# Altium schematic sheet NUCLEO-F410RB-Core.SchDoc: NUCLEO-F410RB 扩展板
size A4; Revision: V1.0
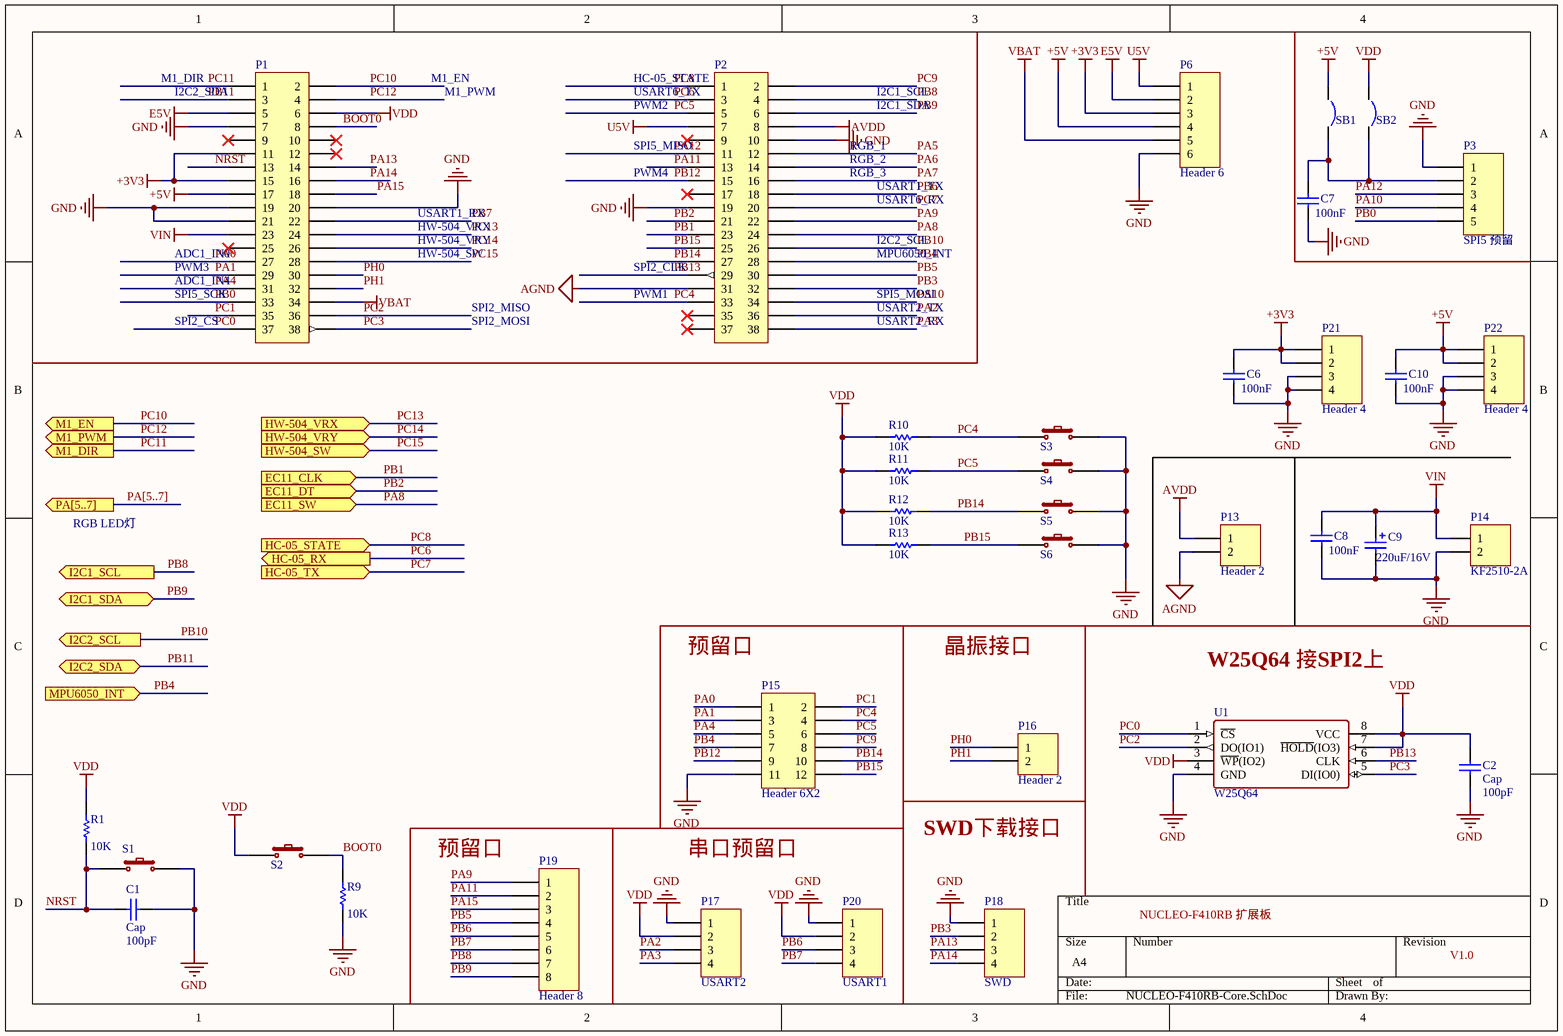
[diagram p0: NUCLEO-F410RB-Core.SchDoc]

## Parts
C1  Cap  value 100pF  [C0603]
C2  Cap  value 100pF  [C0603]
C6  value 100nF  [C0603]  (hidden comment: Cap)
C7  value 100nF  [C0603]  (hidden comment: Cap)
C8  value 100nF  [C0603]  (hidden comment: Cap)
C9  value 220uF/16V  [CAP-TH_BD6.3-P2.50-D1.0-FD]  (hidden comment: Cap Pol1)
C10  value 100nF  [C0603]  (hidden comment: Cap)
P1  HDR-F-2.54_2x19  [HDR2X19]  (value not drawn)
P2  HDR-F-2.54_2x19  [HDR2X19]  (value not drawn)
P3  SPI5 预留  [HDR1X5-Male]
P6  Header 6  [HDR1X6]
P13  Header 2  [HDR1X2]
P14  KF2510-2A  [KF2510-2A]
P15  Header 6X2  [HDR2X6]
P16  Header 2  [HDR1X2]
P17  USART2  [HDR1X4-Male]
P18  SWD  [HDR1X4-Male]
P19  Header 8  [HDR1X8-Male]
P20  USART1  [HDR1X4-Male]
P21  Header 4  [HDR1X4-Male]
P22  Header 4  [HDR1X4-Male]
R1  value 10K  [R0603]  (hidden comment: Res_US)
R9  value 10K  [R0603]  (hidden comment: Res_US)
R10  value 10K  [R0603]  (hidden comment: Res_US)
R11  value 10K  [R0603]  (hidden comment: Res_US)
R12  value 10K  [R0603]  (hidden comment: Res_US)
R13  value 10K  [R0603]  (hidden comment: Res_US)
S1  K2-SMD_L6x_W3.5_LS8.0  [SW-SMD_L6.0-W3.5-LS8.0]  (value not drawn)
S2  K2-SMD_L6x_W3.5_LS8.0  [SW-SMD_L6.0-W3.5-LS8.0]  (value not drawn)
S3  K2-SMD_L6x_W3.5_LS8.0  [SW-SMD_L6.0-W3.5-LS8.0]  (value not drawn)
S4  K2-SMD_L6x_W3.5_LS8.0  [SW-SMD_L6.0-W3.5-LS8.0]  (value not drawn)
S5  K2-SMD_L6x_W3.5_LS8.0  [SW-SMD_L6.0-W3.5-LS8.0]  (value not drawn)
S6  K2-SMD_L6x_W3.5_LS8.0  [SW-SMD_L6.0-W3.5-LS8.0]  (value not drawn)
SB1  Circuit Breaker  [JP2_SMD]  (value not drawn)
SB2  Circuit Breaker  [JP2_SMD]  (value not drawn)
U1  W25Q64  [SOIC-8_208mil_L5.3-W5.3-P1.27-LS8.0-BL]

## Ports
EC11_CLK (in), EC11_DT (in), EC11_SW (in), HC-05_RX (out), HC-05_STATE (in), HC-05_TX (in), HW-504_SW (in), HW-504_VRX (in), HW-504_VRY (in), I2C1_SCL (out), I2C1_SDA (bidir), I2C2_SCL (out), I2C2_SDA (bidir), M1_DIR (out), M1_EN (out), M1_PWM (out), MPU6050_INT (in), PA[5..7] (out)

## Nets
+3V3: C6.2 P1.11 P1.15 P6.3 P21.1 P21.2
+5V: C10.2 P1.17 P6.4 P22.1 P22.2 SB1.1
AGND: P2.31 P13.2
AVDD: P2.8 P13.1
E5V: P1.5 P6.2
GND: C1.2 C2.1 C6.1 C7.1 C8.1 C9.2 C10.1 P1.7 P1.19 P1.20 P1.21 P2.10 P2.19 P3.1 P6.6 P14.2 P15.11 P17.1 P18.1 P20.1 P21.3 P21.4 P22.3 P22.4 R9.1 S1.2 S3.2 S4.2 S5.2 S6.2 U1.4(GND)
U5V: P2.7 P6.1
VBAT: P1.34 P6.5
VDD: C2.2 P1.6 P17.2 P20.2 R1.2 R10.2 R11.2 R12.2 R13.2 S2.1 SB2.1 U1.3(~{WP}(IO2)) U1.7(~{HOLD}(IO3)) U1.8(VCC)
VIN: C8.2 C9.1 P1.23 P14.1
BOOT0: P1.8 R9.2 S2.2
NRST: C1.1 P1.13 R1.1 S1.1
PA0: P1.27 P15.1
PA1: P1.29 P15.3
PA2: P2.36 P17.3
PA3: P2.38 P17.4
PA4: P1.31 P15.5
PA5: P2.12
PA6: P2.14
PA7: P2.16
PA8: P2.24 ; port EC11_SW
PA9: P2.22 P19.1
PA10: P2.34 P3.4
PA11: P2.13 P19.2
PA12: P2.11 P3.3
PA13: P1.14 P18.3
PA14: P1.16 P18.4
PA15: P1.18 P19.3
PB0: P1.33 P3.5
PB1: P2.23 ; port EC11_CLK
PB2: P2.21 ; port EC11_DT
PB3: P2.32 P18.2
PB4: P2.28 P15.7 ; port MPU6050_INT
PB5: P2.30 P19.4
PB6: P2.18 P19.5 P20.3
PB7: P1.22 P19.6 P20.4
PB8: P2.4 P19.7 ; port I2C1_SCL
PB9: P2.6 P19.8 ; port I2C1_SDA
PB10: P2.26 ; port I2C2_SCL
PB11: P1.3 ; port I2C2_SDA
PB12: P2.15 P15.9
PB13: P2.29 U1.6(CLK)
PB14: P2.27 P15.10 R12.1 S5.1
PB15: P2.25 P15.12 R13.1 S6.1
PC0: P1.37 U1.1(~{CS})
PC1: P1.35 P15.2
PC2: P1.36 U1.2(DO(IO1))
PC3: P1.38 U1.5(DI(IO0))
PC4: P2.33 P15.4 R10.1 S3.1
PC5: P2.5 P15.6 R11.1 S4.1
PC6: P2.3 ; port HC-05_RX
PC7: P2.20 ; port HC-05_TX
PC8: P2.1 ; port HC-05_STATE
PC9: P2.2 P15.8
PC10: P1.2 ; port M1_EN
PC11: P1.1 ; port M1_DIR
PC12: P1.4 ; port M1_PWM
PC13: P1.24 ; port HW-504_VRX
PC14: P1.26 ; port HW-504_VRY
PC15: P1.28 ; port HW-504_SW
PH0: P1.30 P16.1
PH1: P1.32 P16.2
NetC7_2: C7.2 P3.2 SB1.2 SB2.2

Not connected (* = marked no-connect by the designer): P1 9* 10* 12* 25*; P2 9* 17* 35* 37*

## Buses and harness runs
bus PA[5..7] = port PA[5..7]

## Notes on the sheet
- M1_DIR
- I2C2_SDA
- M1_EN
- M1_PWM
- USART6_TX
- PWM2
- HC-05_STATE
- I2C1_SDA
- I2C1_SCL
- PWM4
- SPI5_MISO
- (near P2) RGB_1
- (near P2) RGB_2
- (near P2) RGB_3
- (near P1) HW-504_VRX
- (near P1) HW-504_VRY
- (near P1) USART1_RX
- I2C2_SCL
- (near P2) USART6_RX
- (near P2) USART1_TX
- SPI5_SCK
- ADC1_IN4
- PWM3
- ADC1_IN0
- (near P1) HW-504_SW
- SPI2_MISO
- SPI2_CLK
- PWM1
- (near P2) USART2_TX
- (near P2) SPI5_MOSI
- (near P2) MPU6050_INT
- SPI2_CS
- SPI2_MOSI
- (near P2) USART2_RX
- RGB LED灯
- 预留口
- 晶振接口
- W25Q64 接SPI2上
- SWD下载接口
- 串口预留口

## Library data of the parts
C1 C2 = Cap: 无极性电容; Published: 8-Jun-2000; LatestRevisionDate: 17-Jul-2002; LatestRevisionNote: Re-released for DXP Platform.; PackageReference: RAD-0.3; Publisher: Altium Limited; PackageDescription: Radial Cap, Thru-Hole; 2 Leads; 0.3 in Pin Spacing
C6-C8 C10 = Cap: Capacitor; Published: 8-Jun-2000; LatestRevisionDate: 17-Jul-2002; LatestRevisionNote: Re-released for DXP Platform.; PackageReference: RAD-0.3; Publisher: Altium Limited; PackageDescription: Radial Cap, Thru-Hole; 2 Leads; 0.3 in Pin Spacing
C9 = Cap Pol1: 有极性电容; Published: 2020-7-27; Publisher: 信念D力量; LCSC_ID: C18104
P1 P2 = HDR-F-2.54_2x19: 2.54mm 母头排针座; LatestRevisionDate: 17-Jul-2002; LatestRevisionNote: Re-released for DXP Platform.; Publisher: Altium Limited
P3 = Header 5: Header, 5-Pin; LatestRevisionDate: 17-Jul-2002; LatestRevisionNote: Re-released for DXP Platform.; Publisher: Altium Limited
P6 = Header 6: Header, 6-Pin; LatestRevisionDate: 17-Jul-2002; LatestRevisionNote: Re-released for DXP Platform.; Publisher: Altium Limited
P13 P16 = Header 2: Header, 2-Pin; LatestRevisionDate: 17-Jul-2002; LatestRevisionNote: Re-released for DXP Platform.; Publisher: Altium Limited
P14 = KF2510-2A: KF2510-2A 端子; LatestRevisionDate: 17-Jul-2002; LatestRevisionNote: Re-released for DXP Platform.; Publisher: Altium Limited
P15 = Header 6X2: Header, 6-Pin, Dual row; LatestRevisionDate: 17-Jul-2002; LatestRevisionNote: Re-released for DXP Platform.; Publisher: Altium Limited
P17 P18 P20-P22 = Header 4: Header, 4-Pin; LatestRevisionDate: 17-Jul-2002; LatestRevisionNote: Re-released for DXP Platform.; Publisher: Altium Limited
P19 = Header 8: Header, 8-Pin; LatestRevisionDate: 17-Jul-2002; LatestRevisionNote: Re-released for DXP Platform.; Publisher: Altium Limited
R1 R9-R13 = Res_US: Resistor; Published: 8-Jun-2000; LatestRevisionDate: 29-May-2009; LatestRevisionNote: IPC-7351 Footprint Added.; PackageReference: J1-0603; Publisher: Altium Limited; PackageDescription: Chip Resistor
S1-S6 = K2-SMD_L6x_W3.5_LS8.0: 轻触开关 K2-SMD_L6x_W3.5_LS8.0; Published: 24-Mar-1999; LatestRevisionDate: 17-Jul-2002; LatestRevisionNote: Re-released for DXP Platform.; PackageReference: SPST-2; Publisher: Altium Limited; PackageDescription: Switch; 2 Leads
SB1 SB2 = Circuit Breaker: Solder: NO; Published: 24-Mar-1999; Revision: July-2002: Re-released for DXP Platform.; Publisher: Altium Limited
U1 = W25Q64: FLASH存储器